# Altium schematic sheet TopLevel.SchDoc
size Tabloid
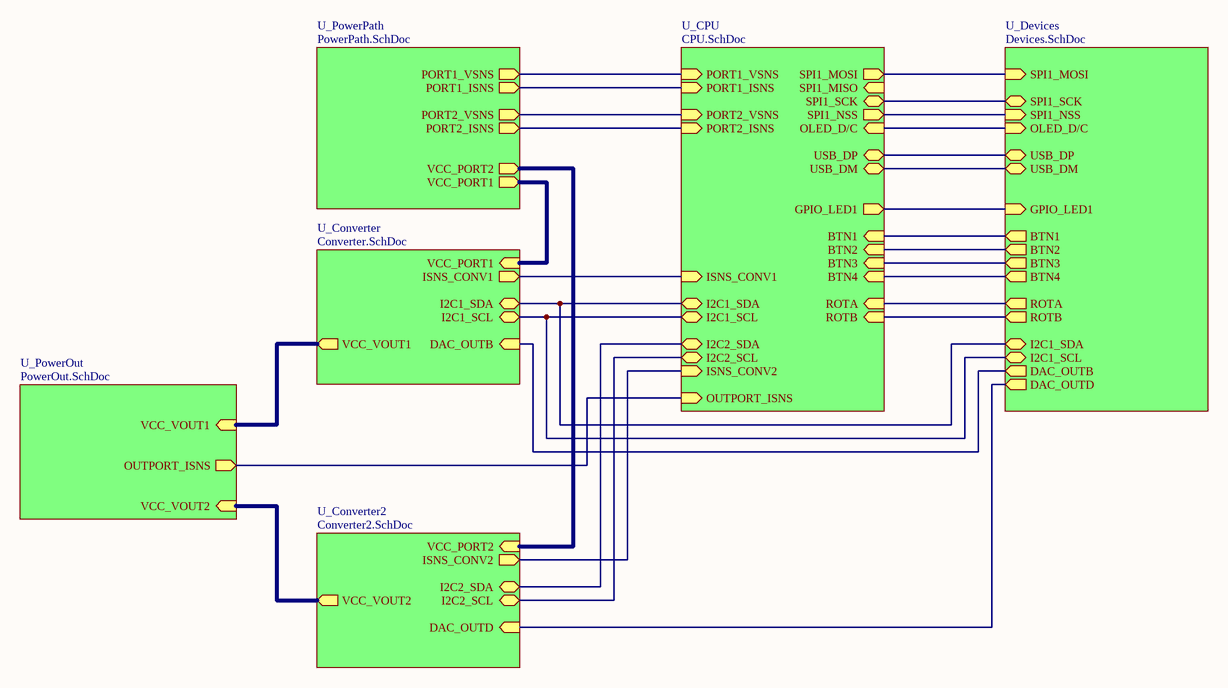
[diagram p0: TopLevel.SchDoc]

## Sub-sheets
U_Converter = Converter.SchDoc: DAC_OUTB (in), I2C1_SDA (bidir), I2C1_SCL (bidir), ISNS_CONV1 (out), VCC_PORT1 (in), VCC_VOUT1 (out)
U_Converter2 = Converter2.SchDoc: DAC_OUTD (in), I2C2_SDA (bidir), I2C2_SCL (bidir), ISNS_CONV2 (out), VCC_PORT2 (in), VCC_VOUT2 (out)
U_CPU = CPU.SchDoc: PORT1_ISNS (in), PORT1_VSNS (in), ISNS_CONV1 (in), SPI1_NSS (out), SPI1_SCK (bidir), SPI1_MISO (in), SPI1_MOSI (out), PORT2_ISNS (in), I2C2_SDA (bidir), I2C2_SCL (bidir), BTN1 (in), BTN2 (in), BTN3 (in), BTN4 (in), GPIO_LED1 (out), USB_DM (bidir), USB_DP (bidir), I2C1_SDA (bidir), I2C1_SCL (bidir), PORT2_VSNS (in), ISNS_CONV2 (in), ROTA (in), ROTB (in), OUTPORT_ISNS (in), OLED_D/C (in)
U_Devices = Devices.SchDoc: DAC_OUTB (out), DAC_OUTD (out), GPIO_LED1 (in), BTN1 (out), BTN2 (out), BTN3 (out), BTN4 (out), USB_DM (bidir), USB_DP (bidir), SPI1_NSS (in), SPI1_SCK (bidir), SPI1_MOSI (in), I2C1_SDA (bidir), I2C1_SCL (bidir), ROTA (out), ROTB (out), OLED_D/C (in)
U_PowerOut = PowerOut.SchDoc: VCC_VOUT1 (in), VCC_VOUT2 (in), OUTPORT_ISNS (out)
U_PowerPath = PowerPath.SchDoc: PORT1_VSNS (out), PORT2_VSNS (out), PORT2_ISNS (out), PORT1_ISNS (out), VCC_PORT1 (out), VCC_PORT2 (out)

## Nets
(unnamed): sheet U_Converter/DAC_OUTB, sheet U_Devices/DAC_OUTB
(unnamed): sheet U_Converter/I2C1_SDA, sheet U_Devices/I2C1_SDA, sheet U_CPU/I2C1_SDA
(unnamed): sheet U_Converter/I2C1_SCL, sheet U_Devices/I2C1_SCL, sheet U_CPU/I2C1_SCL
(unnamed): sheet U_Converter/ISNS_CONV1, sheet U_CPU/ISNS_CONV1
(unnamed): sheet U_Converter/VCC_PORT1, sheet U_PowerPath/VCC_PORT1
(unnamed): sheet U_Converter/VCC_VOUT1, sheet U_PowerOut/VCC_VOUT1
(unnamed): sheet U_Devices/DAC_OUTD, sheet U_Converter2/DAC_OUTD
(unnamed): sheet U_Devices/GPIO_LED1, sheet U_CPU/GPIO_LED1
(unnamed): sheet U_Devices/BTN1, sheet U_CPU/BTN1
(unnamed): sheet U_Devices/BTN2, sheet U_CPU/BTN2
(unnamed): sheet U_Devices/BTN3, sheet U_CPU/BTN3
(unnamed): sheet U_Devices/BTN4, sheet U_CPU/BTN4
(unnamed): sheet U_Devices/USB_DM, sheet U_CPU/USB_DM
(unnamed): sheet U_Devices/USB_DP, sheet U_CPU/USB_DP
(unnamed): sheet U_Devices/SPI1_NSS, sheet U_CPU/SPI1_NSS
(unnamed): sheet U_Devices/SPI1_SCK, sheet U_CPU/SPI1_SCK
(unnamed): sheet U_Devices/SPI1_MOSI, sheet U_CPU/SPI1_MOSI
(unnamed): sheet U_Devices/ROTA, sheet U_CPU/ROTA
(unnamed): sheet U_Devices/ROTB, sheet U_CPU/ROTB
(unnamed): sheet U_Devices/OLED_D/C, sheet U_CPU/OLED_D/C
(unnamed): sheet U_PowerPath/PORT1_VSNS, sheet U_CPU/PORT1_VSNS
(unnamed): sheet U_PowerPath/PORT2_VSNS, sheet U_CPU/PORT2_VSNS
(unnamed): sheet U_PowerPath/PORT2_ISNS, sheet U_CPU/PORT2_ISNS
(unnamed): sheet U_PowerPath/PORT1_ISNS, sheet U_CPU/PORT1_ISNS
(unnamed): sheet U_PowerPath/VCC_PORT2, sheet U_Converter2/VCC_PORT2
(unnamed): sheet U_CPU/I2C2_SDA, sheet U_Converter2/I2C2_SDA
(unnamed): sheet U_CPU/I2C2_SCL, sheet U_Converter2/I2C2_SCL
(unnamed): sheet U_CPU/ISNS_CONV2, sheet U_Converter2/ISNS_CONV2
(unnamed): sheet U_CPU/OUTPORT_ISNS, sheet U_PowerOut/OUTPORT_ISNS
(unnamed): sheet U_PowerOut/VCC_VOUT2, sheet U_Converter2/VCC_VOUT2